# Altium schematic sheet 7_kbd.SchDoc
size A
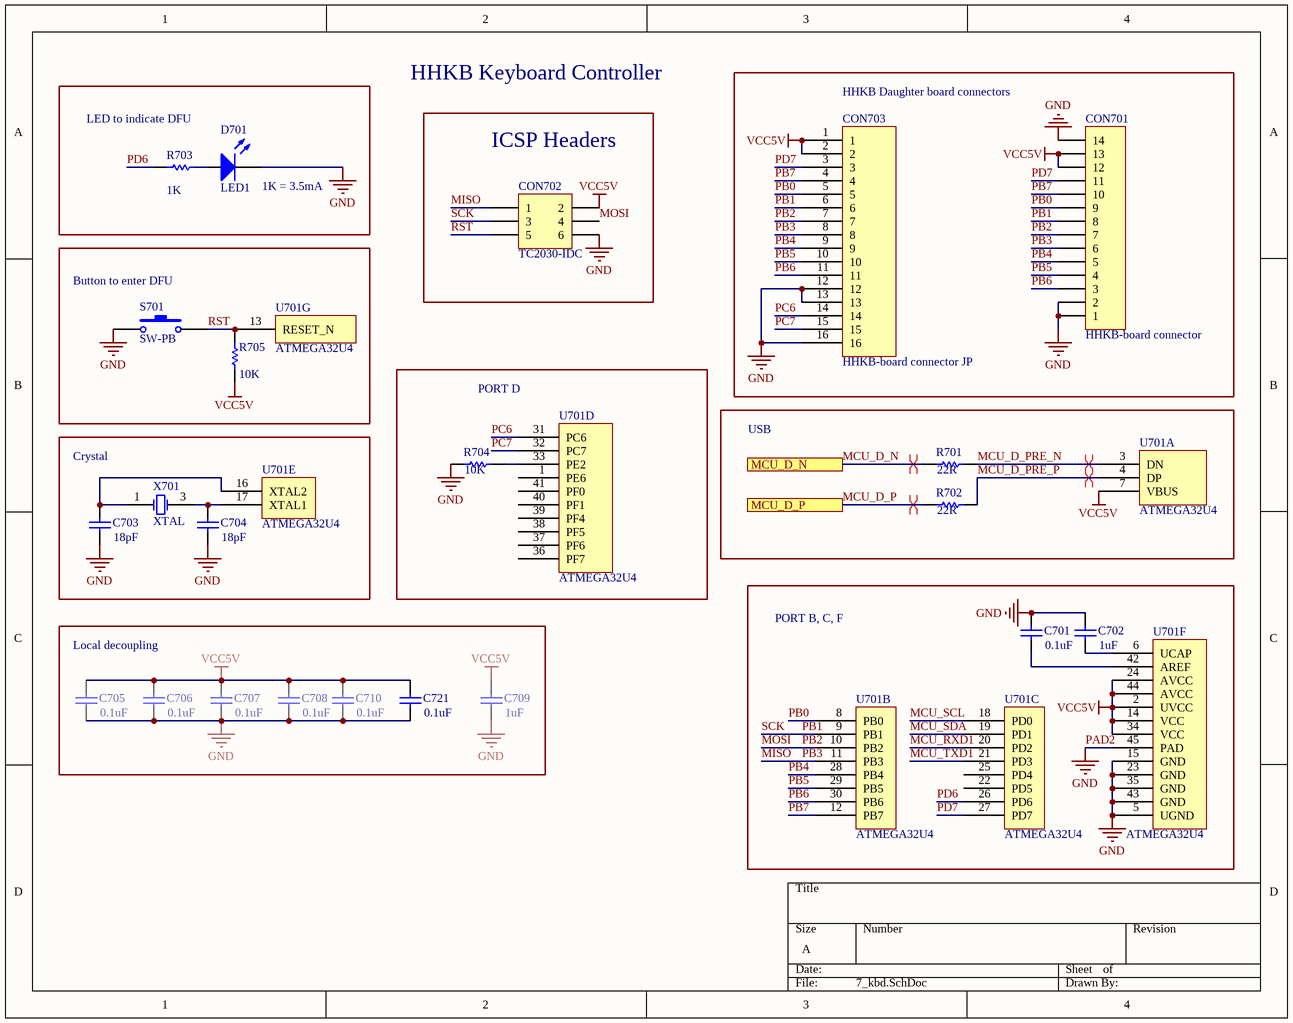
[diagram p0: 7_kbd.SchDoc]

## Parts
C701  value 0.1uF  [C0603[1608]]
C702  value 1uF  [C0603[1608]]
C703  value 18pF  [C0603[1608]]
C704  value 18pF  [C0603[1608]]
C705  value 0.1uF  [C0603[1608]]
C706  value 0.1uF  [C0603[1608]]
C707  value 0.1uF  [C0603[1608]]
C708  value 0.1uF  [C0603[1608]]
C709  value 1uF  [C0603[1608]]
C710  value 0.1uF  [C0603[1608]]
C721  value 0.1uF  [C0603[1608]]
CON701  HHKB-board connector  [JST S13B-ZR-SM4A-TF(LF)(SN)]
CON702  TC2030-IDC  [TC2030-IDC-NL]  (no BOM)
CON703  HHKB-board connector JP  [DF14A-15P-1.25H]  (no BOM)
D701  LED1  [KINGBRIGHT WP934EW]
R701  value 22R  [R0603[1608]]
R702  value 22R  [R0603[1608]]
R703  value 1K  [R0603[1608]]
R704  value 10K  [R0603[1608]]
R705  value 10K  [R0603[1608]]
S701  SW-PB  [Wurth 431256038736]
U701  ATMEGA32U4  [ATMEGA32U4]  (parts A,B,C,D,E,F,G of 7)
X701  XTAL  [XTAL-3225]

## Blocks framed on the sheet
HHKB Daughter board connectors: CON701 CON703
ICSP Headers: CON702
Button to enter DFU: R705 S701 U701
PORT D: R704 U701
Crystal: C703 C704 U701 X701
USB: R701 R702 U701
PORT B, C, F: C701 C702 U701
Local decoupling: C705-C710 C721

## Ports
MCU_D_N, MCU_D_P

## Nets
PAD2: C701.2 C702.2 C703.1 C704.1 C705.1 C706.1 C707.1 C708.1 C709.1 C710.1 C721.1 CON701.1 CON701.2 CON701.14 CON702.6 CON703.12 CON703.13 CON703.16 D701.1(K) R704.1 S701.2 S701.3(GND) U701.5(UGND) U701.15(GND) U701.23(GND) U701.35(GND) U701.43(GND) U701.45(PAD) X701.2(GND) X701.4(GND)  [also labelled GND]
VCC5V: C705.2 C706.2 C707.2 C708.2 C709.2 C710.2 C721.2 CON701.12 CON701.13 CON702.2 CON703.1 CON703.2 R705.2 U701.2(UVCC) U701.7(VBUS) U701.14(VCC) U701.24(AVCC) U701.34(VCC) U701.44(AVCC)
MCU_D_N: R701.1 ; port MCU_D_N
MCU_D_P: R702.1 ; port MCU_D_P
MCU_D_PRE_N: R701.2 U701.3(DN)
MCU_D_PRE_P: R702.2 U701.4(DP)
MCU_RXD1: U701.20(PD2)
MCU_SCL: U701.18(PD0)
MCU_SDA: U701.19(PD1)
MCU_TXD1: U701.21(PD3)
MISO: CON701.6 CON702.1 CON703.8 U701.11(PB3)  [also labelled PB3]
MOSI: CON701.7 CON702.4 CON703.7 U701.10(PB2)  [also labelled PB2]
PB0: CON701.9 CON703.5 U701.8(PB0)
PB1: CON701.8 CON702.3 CON703.6 U701.9(PB1)  [also labelled SCK]
PB4: CON701.5 CON703.9 U701.28(PB4)
PB5: CON701.4 CON703.10 U701.29(PB5)
PB6: CON701.3 CON703.11 U701.30(PB6)
PB7: CON701.10 CON703.4 U701.12(PB7)
PC6: CON703.14 U701.31(PC6)
PC7: CON703.15 U701.32(PC7)
PD6: R703.1 U701.26(PD6)
PD7: CON701.11 CON703.3 U701.27(PD7)
RST: CON702.5 R705.1 S701.1 U701.13(RESET_N)
NetC701_1: C701.1 U701.42(AREF)
NetC702_1: C702.1 U701.6(UCAP)
NetC703_2: C703.2 U701.16(XTAL2) X701.1(OSC1)
NetC704_2: C704.2 U701.17(XTAL1) X701.3(OSC2)
NetD701_2: D701.2(A) R703.2
NetR704_2: R704.2 U701.33(PE2)

Not connected (* = marked no-connect by the designer): U701 1(PE6) 22(PD5) 25(PD4) 36(PF7) 37(PF6) 38(PF5) 39(PF4) 40(PF1) 41(PF0)

## Layout directives
differential pair: MCU_D_N, MCU_D_P, MCU_D_PRE_N, MCU_D_PRE_P

## Notes on the sheet
- HHKB Keyboard Controller
- LED to indicate DFU
- (near D701) 1K = 3.5mA

## Library data of the parts
C701 C705-C708 C710 C721 = Cap: Capacitor; MRF.Part: CC0603KRX7R9BB104; MFG: KEMET; MFGPN: C0603C104M5RACTU; LCSC MFG: YAGEO; Version: 0603 imperial; JLC: BASIC; LCSC Part #: C14663
C702 C709 = Cap: Capacitor; MRF.Part: CL10A105KB8NNNC; MFG: KEMET; MFGPN: C0603C105K4RACTU; LCSC MFG: Samsung Electro-Mechanics; Version: 0603 imperial; JLC: BASIC; LCSC Part #: C15849
C703 C704 = Cap: Capacitor; MRF.Part: CL10C180JB8NNNC; MFG: KEMET; MFGPN: C0603C180J5GACAUTO; LCSC MFG: Samsung Electro-Mechanics; Version: 0603 imperial; JLC: BASIC; LCSC Part #: C1647
CON701 = Header 14: MFGPN: S13B-ZR-SM4A-TF(LF)(SN); MFG: JST Sales America Inc; JLC: NONE
CON702 = Header 3X2: Header, 3-Pin, Dual row; JLC: DNP
CON703 = DF14A-15P-1.25H: MFG: Hirose Electric Co Ltd; MFGPN: DF14A-15P-1.25H(26); JLC: NONE
D701 = LED1: Typical RED GaAs LED; MRF.Part: MHK1373CGBCT; MFGPN: WP934EW/GD; MFG: Kingbright; LCSC MFG: MEIHUA; Version: Kingsbright LED; LCSC Part #: C417351; JLC: NONE
R701 R702 = Res1: Resistor; MRF.Part: 0603WAF220JT5E  0603WAF220JT5E; MFG: Vishay Dale; MFGPN: CRCW060322R0FKEAC; LCSC MFG: Uniroyal Elec; Version: 0603 imperial; JLC: BASIC; LCSC Part #: C23345
R703 = Res1: Resistor; MRF.Part: 0603WAF1001T5E; MFG: Vishay Dale; MFGPN: RCA06031K00FKEA; LCSC MFG: Uniroyal Elec; Version: 0603 imperial; JLC: BASIC; LCSC Part #: C21191
R704 R705 = Res1: Resistor; MRF.Part: 0603WAF1002T5E; MFG: Vishay Dale; MFGPN: RCA060310K0FKEA; LCSC MFG: Uniroyal Elec; Version: 0603 imperial; JLC: BASIC; LCSC Part #: C25804
S701 = SW-PB: Switch; MRF.Part: K2-1102AQ-C4CW-01; MFGPN: 431256038736; MFG: Wurth Electronics Inc; LCSC MFG: Korean Hroparts Elec; LCSC Part #: C127680; JLC: NONE
U701 = ATMEGA32U4: MFG: Microchip Technology; MFGPN: ATMEGA32U4-MUR; LCSC MFG: Microchip Tech; LCSC Part #: C45874; MRF.Part: ATMEGA32U4-MUR; JLC: EXTENDED
X701 = XTAL: Crystal Oscillator; MRF.Part: X322516MLB4SI; LCSC MFG: Yangxing Tech; LCSC Part #: C13738; JLC: BASIC